# EAGLE design pcb_power (EAGLE 9.5.1)
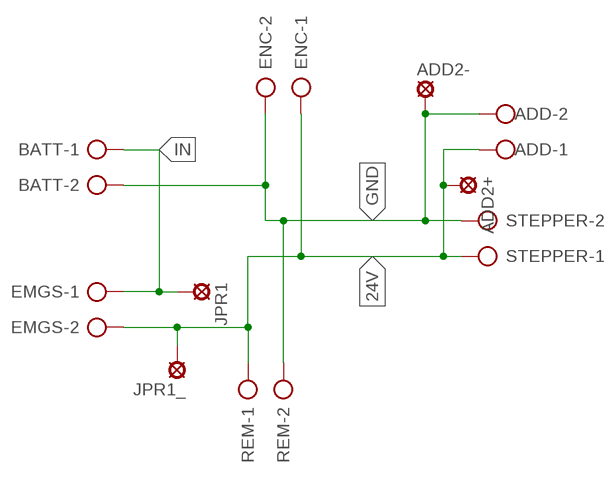
[diagram p0: schematic, sheet 1]

## Parts
ADD  W237-102  [W237-102]
ADD2+  SE14  [SE14]
ADD2-  SE14  [SE14]
BATT  W237-102  [W237-102]
EMGS  W237-102  [W237-102]
ENC  W237-102  [W237-102]
JPR1  SE14  [SE14]
JPR1_  SE14  [SE14]
REM  W237-102  [W237-102]
STEPPER  W237-102  [W237-102]

## Nets
24V [PWR]: ADD2+.MP ADD.1 EMGS.2 ENC.1 JPR1_.MP REM.1 STEPPER.1
GND [GND]: ADD2-.MP ADD.2 BATT.2 ENC.2 REM.2 STEPPER.2
IN [PWR]: BATT.1 EMGS.1 JPR1.MP

## Library data of the parts
ADD BATT EMGS ENC REM STEPPER = con-wago-500:W237-102: WAGO SCREW CLAMP; MPN: 237-102; OC_FARNELL: unknown; OC_NEWARK: 70K9898
ADD2+ ADD2- JPR1 JPR1_ = solpad:SE14: SOLDER PAD E1553, drill 1,4mm, distributor Buerklin, 07F820

## Net classes
1 PWR: width 2.54 mm, clearance 0.406 mm
2 GND: width 2.54 mm, clearance 0.813 mm

## Board
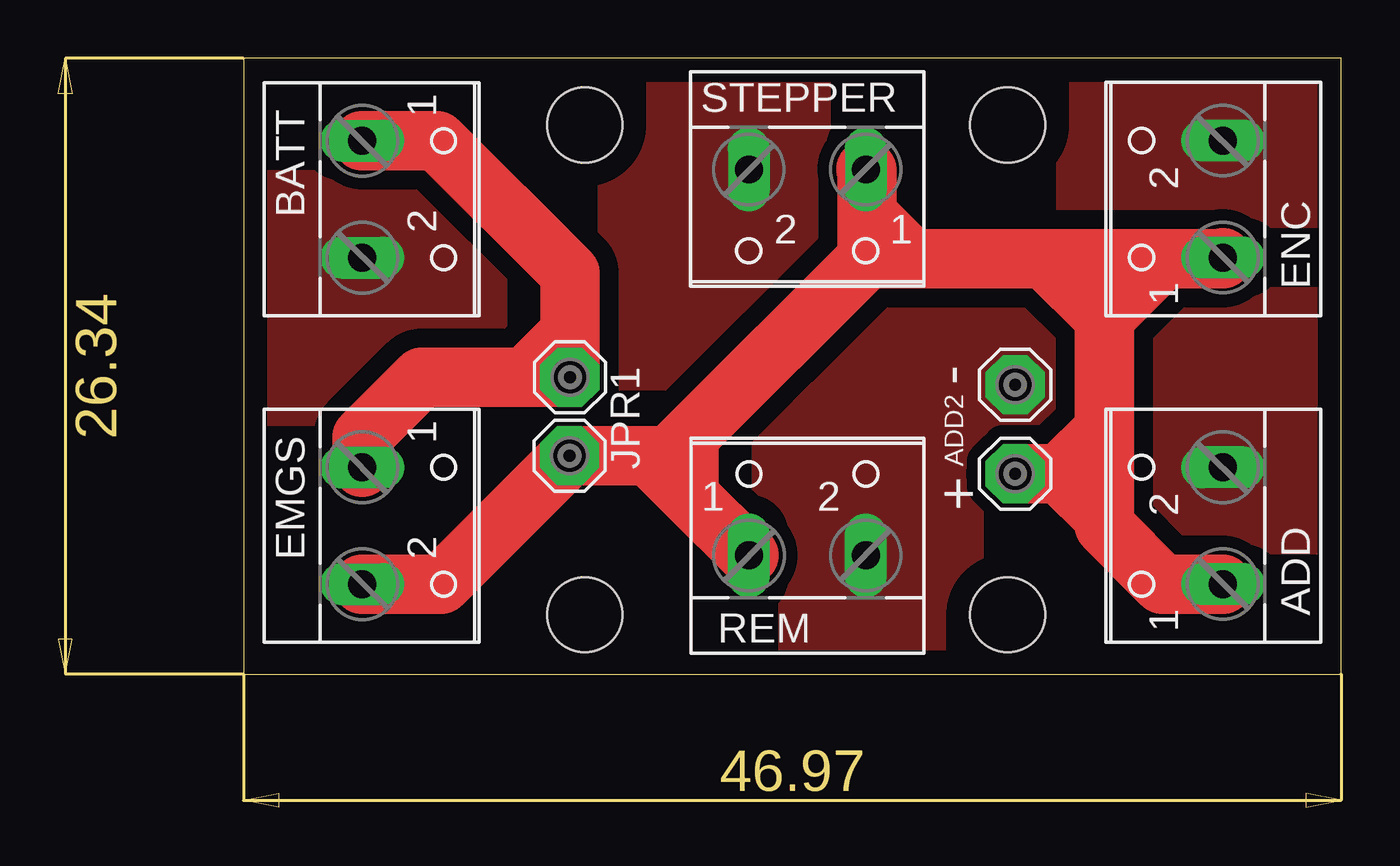
[diagram p1: board, top side]
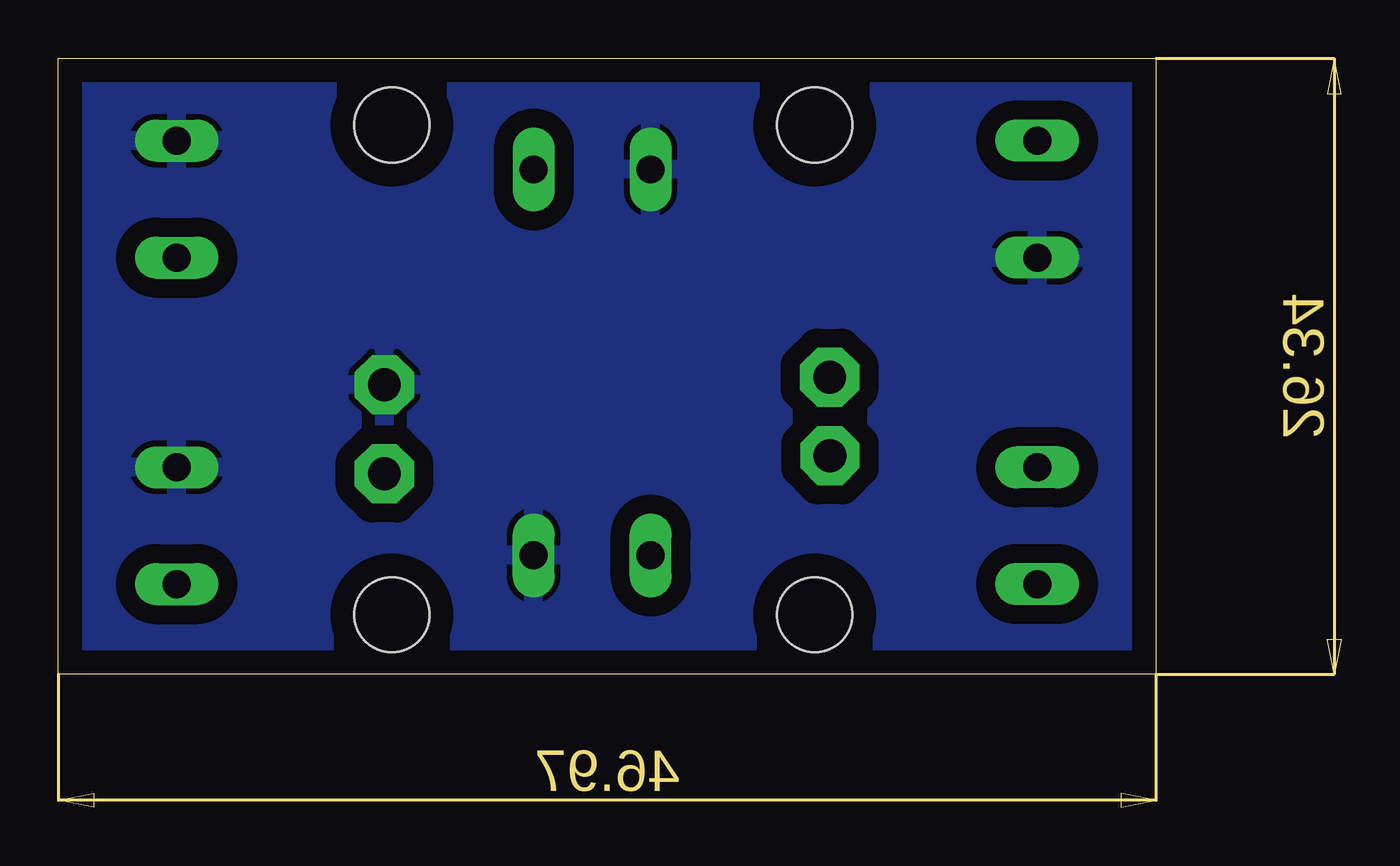
[diagram p2: board, bottom side, seen from below]

Size 46.97 x 26.34 mm. Coordinates in mm from the lower left corner, seen from the top.
Outline: 0,0 46.97,0 46.97,26.34 0,26.34 0,0
Copper layers (1*16): Top 0.035mm / dielectric 1.5mm / Bottom 0.035mm
Design rules "default": minimum track width 6mil, minimum drill 0.35mm, track to track 6mil, track to pad 6mil, pad to pad 6mil, via to via 6mil, smd to smd 6mil, copper to edge 40mil, drill to drill 6mil, minimum pad ring 10mil, minimum via ring 8mil, stop-mask expansion 4mil, vias tented up to drill 0mil, thermal gap 10mil
Holes 3.2 mm at 14.61,2.54 14.61,23.5 32.7,23.5 32.7,2.54

### Footprints (pad centres in the part's own frame; a part is rotated, then mirrored left to right if it is on the bottom)
W237-102 = drill 1.194 long: 1 -2.5,-1.27; 2 2.5,-1.27
SE14 = drill 1.397 pad 2.54 octagon: MP 0,0

### Placement (x,y rotation side)
ADD  40.64,6.35 90 top
ADD2+  33.02,8.57 270 top
ADD2-  33.02,12.38 90 top
BATT  6.35,20.32 270 top
EMGS  6.35,6.35 270 top
ENC  40.64,20.32 90 top
JPR1  13.97,12.7 0 top
JPR1_  13.95,9.35 0 top
REM  24.13,6.35 0 top
STEPPER  24.13,20.32 180 top

### Tracks (layer width: path | path; a pad name or v marks a point on that pad's centre or on a via)
24V
  Top 2.54: EMGS.2 8.46,3.85 JPR1_.MP | JPR1_.MP 17.36,9.35 19.07,7.64 | 19.07,7.64 REM.1 | 19.07,10.18 18.24,9.35 JPR1_.MP | 19.07,10.18 26.67,17.78 | 26.67,17.78 26.67,19.68 | 26.67,19.68 26.67,21.55 STEPPER.1 | 39.37,17.78 41.91,17.78 ENC.1 | 39.37,17.78 36.83,15.24 | 36.83,15.24 36.83,10.48 | 36.83,10.48 36.83,6.67 | ADD.1 39.33,3.85 36.83,6.35 36.83,6.67 | 19.07,7.64 19.07,10.18 | 26.67,17.78 28.57,17.78 | 28.57,17.78 34.29,17.78 | 34.29,17.78 39.37,17.78 | 34.29,17.78 36.83,15.24 | 26.67,19.68 28.57,17.78 | ADD2+.MP 34.92,8.57 | 34.92,8.57 36.83,10.48 | 34.92,8.57 36.83,6.67
GND
  pour Top: 1.27,27.94 50.8,27.94 50.8,-2.54 -2.54,-2.54 -2.54,24.13
  pour Bottom: -2.54,27.94 -2.54,-2.54 50.8,-2.54 50.8,27.94
IN
  Top 2.54: BATT.1 8.29,22.82 13.97,17.14 13.97,14.61 | 13.97,14.61 JPR1.MP 12.06,12.7 | 12.06,12.7 7.62,12.7 5.08,10.16 EMGS.1 | 12.06,12.7 13.97,14.61

### Text on the board
tNames: - | ADD2 | +